# Altium schematic sheet [1]_STLU01.SchDoc
size B
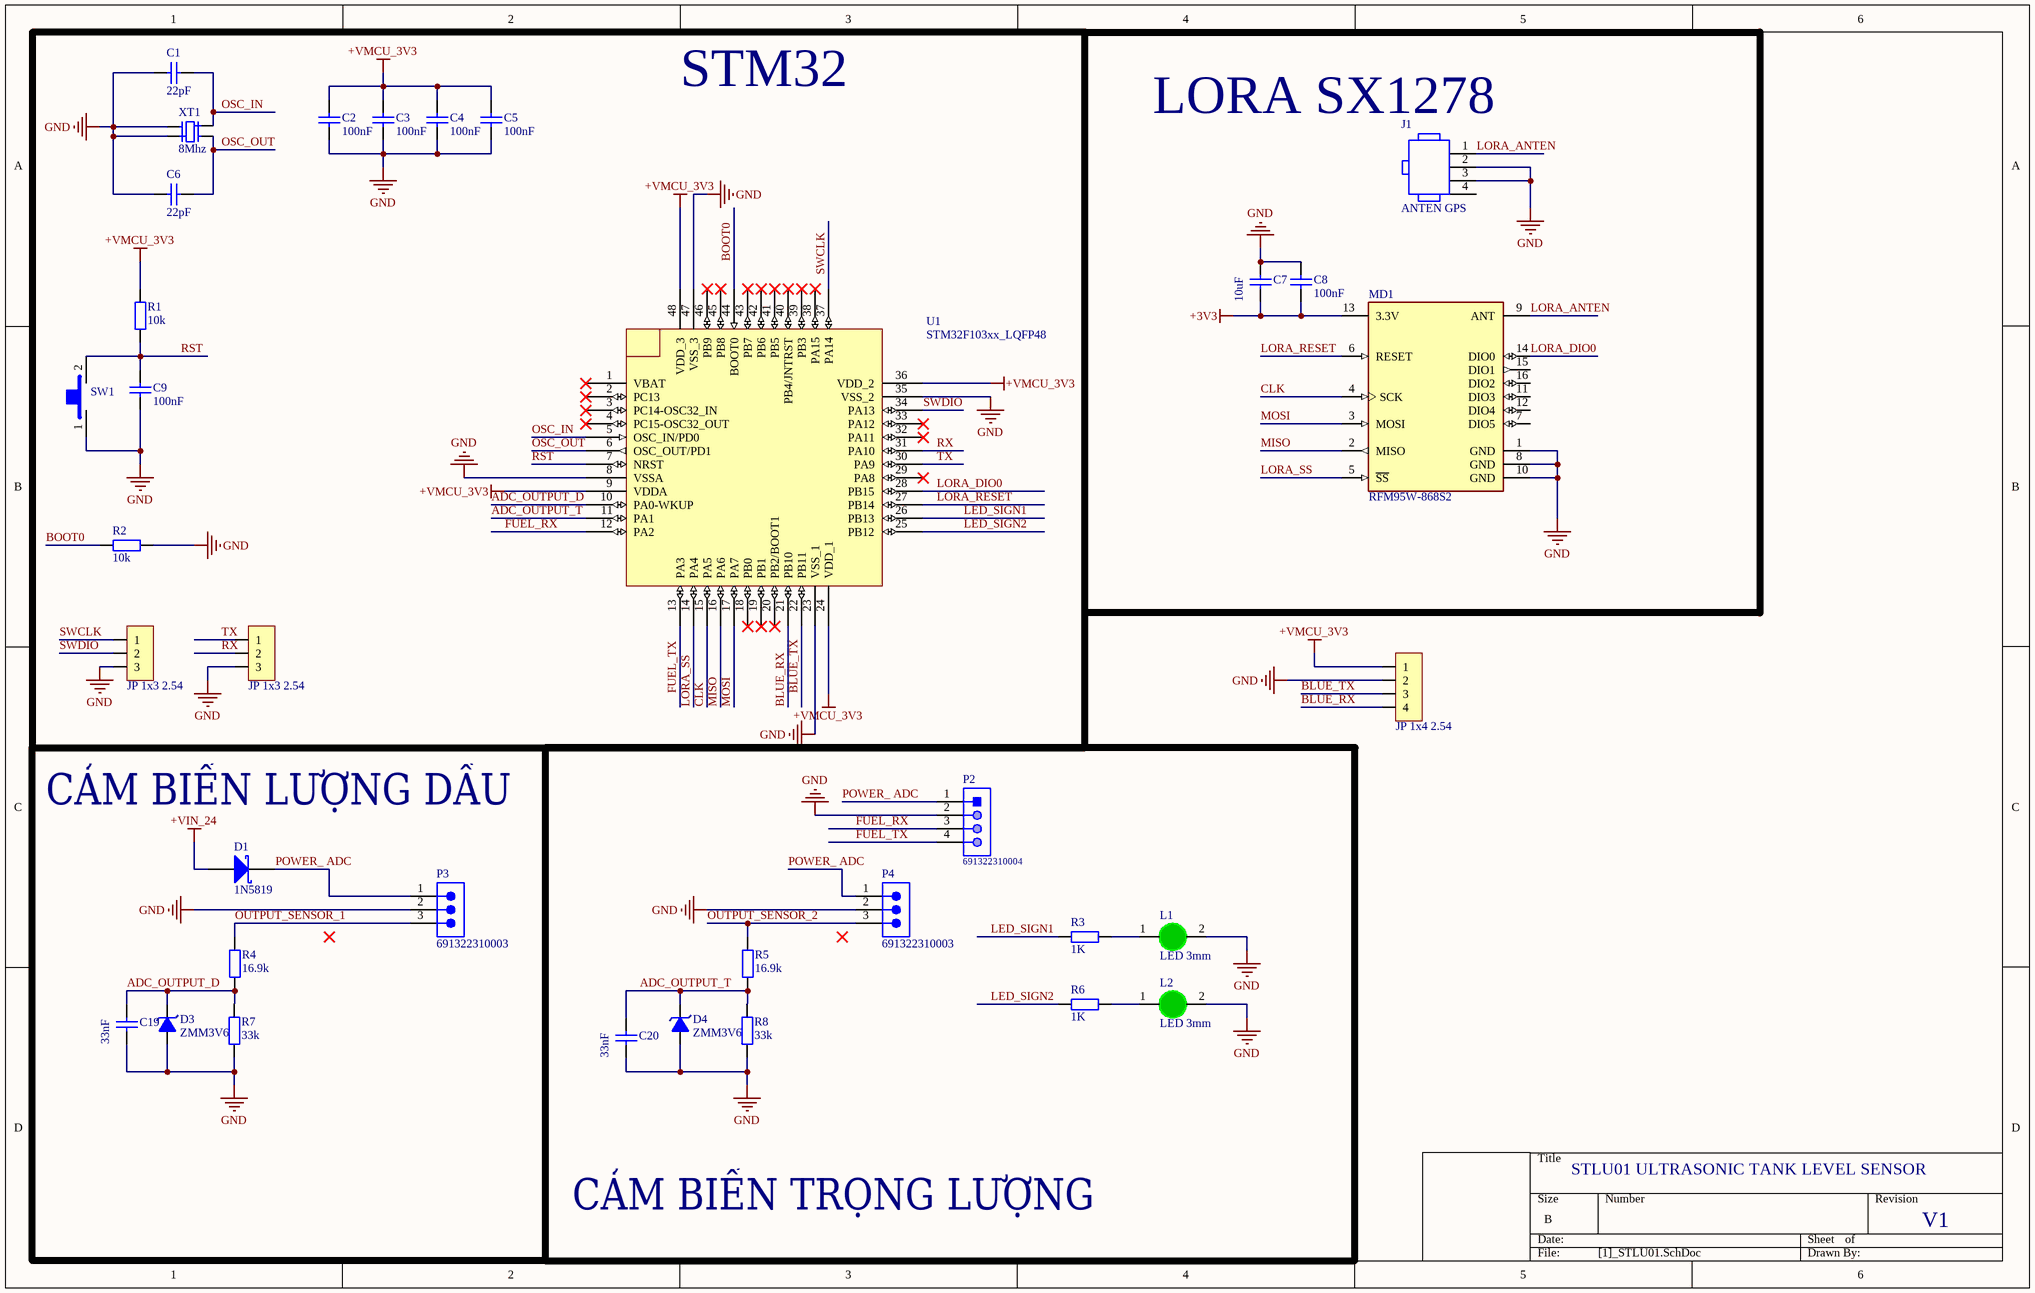
[diagram p0: [1]_STLU01.SchDoc]

## Parts
C1  22pF  [tu 0603]
C2  100nF  [tu 0603]
C3  100nF  [tu 0603]
C4  100nF  [tu 0603]
C5  100nF  [tu 0603]
C6  22pF  [tu 0603]
C7  10uF  [tu 0603]
C8  100nF  [tu 0603]
C9  100nF  [tu 0603]
C19  33nF  [tu 0603]
C20  33nF  [tu 0603]
D1  1N5819  [DO-214AA]
D3  ZMM3V6  [SOD_80]
D4  ZMM3V6  [SOD_80]
J1  ANTEN GPS  [TG-RECE-20369-001E-4_V]
JP1  JP 1x3 2.54  [JP 1x3 DT]
JP2  JP 1x3 2.54  [JP 1x3 DT]
JP3  JP 1x4 2.54  [JP 1x4 DT]
L1  LED 3mm  [LED-3MM-GREEN]
L2  LED 3mm  [LED-3MM-GREEN]
MD1  RFM95W-868S2  [FP-RFM95W-868S2-MFG]
P2  691322310004  [691322310004]
P3  691322310003  [691322310003]
P4  691322310003  [691322310003]
R1  10k  [tro smd 0603]
R2  10k  [tro smd 0603]
R3  1K  [tro smd 0805]
R4  16.9k  [tro smd 0805]
R5  16.9k  [tro smd 0805]
R6  1K  [tro smd 0805]
R7  33k  [tro smd 0805]
R8  33k  [tro smd 0805]
SW1  Tactile  [SW 2P SMD]  (value not drawn)
U1  STM32F103xx_LQFP48  [STM32_LQPF48]
XT1  8Mhz  [Thach Anh 4 chan 1]

## Blocks framed on the sheet
STM32: C1-C6 C9 JP1 JP2 R1 R2 SW1 U1 XT1
CẢM BIẾN LƯỢNG DẦU: C19 D1 D3 P3 R4 R7
CẢM BIẾN TRỌNG LƯỢNG: C20 D4 L1 L2 P2 P4 R3 R5 R6 R8

## Nets
+3V3: C7.2 C8.2 MD1.13(3.3V)
+VIN_24: D1.1(A)
+VMCU_3V3: C2.1 C3.1 C4.1 C5.1 JP3.1 R1.2 U1.9(VDDA) U1.24(VDD_1) U1.36(VDD_2) U1.48(VDD_3)
GND: C1.2 C2.2 C3.2 C4.2 C5.2 C6.2 C7.1 C8.1 C9.2 C19.2 C20.2 D3.1(A) D4.1(A) J1.2 J1.3 JP1.3 JP2.3 JP3.2 L1.2(K) L2.2(K) MD1.1(GND) MD1.8(GND) MD1.10(GND) P2.2 P3.2 P4.2 R2.1 R7.1 R8.1 SW1.1 U1.8(VSSA) U1.23(VSS_1) U1.35(VSS_2) U1.47(VSS_3) XT1.2 XT1.4
ADC_OUTPUT_D: C19.1 D3.2(K) R4.1 R7.2 U1.10(PA0-WKUP)
ADC_OUTPUT_T: C20.1 D4.2(K) R5.1 R8.2 U1.11(PA1)
BLUE_RX: JP3.4 U1.21(PB10)
BLUE_TX: JP3.3 U1.22(PB11)
BOOT0: R2.2 U1.44(BOOT0)
CLK: MD1.4(SCK) U1.15(PA5)
FUEL_RX: P2.3 U1.12(PA2)
FUEL_TX: P2.4 U1.13(PA3)
LED_SIGN1: R3.2 U1.26(PB13)
LED_SIGN2: R6.2 U1.25(PB12)
LORA_ANTEN: J1.1 MD1.9(ANT)
LORA_DIO0: MD1.14(DIO0) U1.28(PB15)
LORA_RESET: MD1.6(RESET) U1.27(PB14)
LORA_SS: MD1.5(~{SS}) U1.14(PA4)
MISO: MD1.2(MISO) U1.16(PA6)
MOSI: MD1.3(MOSI) U1.17(PA7)
OSC_IN: C1.1 U1.5(OSC_IN/PD0) XT1.3
OSC_OUT: C6.1 U1.6(OSC_OUT/PD1) XT1.1
OUTPUT_SENSOR_1: P3.3 R4.2
OUTPUT_SENSOR_2: P4.3 R5.2
POWER_ ADC: D1.2(K) P2.1 P3.1 P4.1
RST: C9.1 R1.1 SW1.2 U1.7(NRST)
RX: JP2.2 U1.31(PA10)
SWCLK: JP1.1 U1.37(PA14)
SWDIO: JP1.2 U1.34(PA13)
TX: JP2.1 U1.30(PA9)
NetL1_1: L1.1(A) R3.1
NetL2_1: L2.1(A) R6.1

Not connected (* = marked no-connect by the designer): J1 4; MD1 7(DIO5) 11(DIO3) 12(DIO4) 15(DIO1) 16(DIO2); U1 1(VBAT)* 2(PC13)* 3(PC14-OSC32_IN)* 4(PC15-OSC32_OUT)* 18(PB0)* 19(PB1)* 20(PB2/BOOT1)* 29(PA8)* 32(PA11)* 33(PA12)* 38(PA15)* 39(PB3)* 40(PB4/JNTRST)* 41(PB5)* 42(PB6)* 43(PB7)* 45(PB8)* 46(PB9)*

## Notes on the sheet
- (near J1) LORA SX1278
- STLU01 ULTRASONIC TANK LEVEL SENSOR
- V1

## Library data of the parts
C1 C6 = Tu 0603 101 50V 10%: Dán; Don_Vi: Con; So_Chan: 2; Ten_Linh_Kien: Tụ 0603 101-0.1nF 10% 50V; Ma_Hang: MH004565; Chung_Loai: Dán; Kieu_Chan: *
C2-C5 C8 = Tu 0603 104 50V 10%: Dán; Don_Vi: Con; So_Chan: 2; Ten_Linh_Kien: Tụ 0603 104-100nF 10% 50V; Ma_Hang: MH004568; Chung_Loai: Dán; Kieu_Chan: *
C7 C19 C20 = Tu 0603 105 16V 20%: Dán; Don_Vi: Con; So_Chan: 2; Ten_Linh_Kien: Tụ 0603 105-1uF 20% 16V; Ma_Hang: MH004574; Chung_Loai: Dán; Kieu_Chan: *
C9 = Tu 0603 105 50V 10%: Dán; Don_Vi: Con; So_Chan: 2; Ten_Linh_Kien: Tụ 0603 105-1uF 50V 10%; Ma_Hang: MH004569; Chung_Loai: Dán; Kieu_Chan: *
D1 = DIO_SS14: DIODE SCHOTTKY 1A 40V SMA DO-214AA; Manufacturer: Fairchild; Part number: SS14; Cost: 600; Package: DO-214AA; ComponentLink1Description: Link product; ComponentLink1URL: https://www.thegioiic.com/ss14-sma-diode-schottky-1a-1n5819
D3 D4 = DIO_ZMM3V6: ZMM3V6 3.6V 500mW SMD SOD-80; Manufacturer: On Semiconductor; Cost: 250; Part number: ZMM3V6; Package: SOD-80; ComponentLink1Description: Link product; ComponentLink1URL: https://www.thegioiic.com/zmm3v6-diode-zener-3-6v-500mw-smd
J1 = CMP-0275-00001-2: RF Connector, Onboard Receptacle, IPEX MHFIII; Manufacturer: Taoglas; PartNumber: RECE-20369-001E-01; Packing: Tape and Reel; Mounting Technology: Surface Mount; PackageReference: RECE-20369-001E-01-4; ComponentLink1URL: http://www.taoglas.com/; Housing Color: Gold; DatasheetVersion: Rev. C; ComponentLink2URL: http://www.taoglas.com/images/product_images/original_images/RECE.20369.001E.01.pdf; ComponentLink3Description: Package Specification; PackageVersion: Rev. C; ComponentLink1Description: Manufacturer URL; ComponentLink2Description: Datasheet; PackageDescription: 4-Pin, Hand Drawn, Body 1.7x1.7mm; ComponentLink3URL: http://www.taoglas.com/images/product_images/original_images/RECE.20369.001E.01.pdf
JP1 JP2 = JP 1x3 2.54 Duc Thang: Cắm; Ten_Linh_Kien: Jump Đơn Đực 2.54MM 1x40P Thẳng 11MM; Don_Vi: Con; Ma_Hang: MH000903; Ghi_Chu: *; Kieu_Chan: *; Chung_Loai: Cắm
JP3 = JP 1x4 2.54 Duc Thang: Cắm; Ten_Linh_Kien: Jump Đơn Đực 2.54MM 1x40P Thẳng 11MM; Don_Vi: Con; Ma_Hang: MH000903; Ghi_Chu: *; Kieu_Chan: *; Chung_Loai: Cắm
L1 L2 = LED 3mm Xanh La: Cắm; Don_Vi: Con; Ma_Hang: MH001054; Ten_Linh_Kien: Led 3MM Phủ Xanh (10c); Ghi_Chu: *; Kieu_Chan: *; Chung_Loai: Cắm
MD1 = CMP-204316-000001-1: RX TXRX MODULE ISM < 1GHZ SMD; Data Rate: 300Kbps; Frequency: 868MHz; Sensitivity: -123dBm; Interface: SPI; Current - Transmitting: 120mA; Current - Receiving: 12.1mA; Max Operating Temperature: 70°C; Case/Package: SMD/SMT; Packaging: Bulk; Mount: Surface Mount; Min Operating Temperature: -20°C
P2 = CMP-1502-01888-1: Serie 322 - 3.81mm Horizontal PCB Header WR-TBL, 4 pin; Manufacturer: Wurth Elektronik; Gender: Male; Pin Number: 4; Package Reference: 691322310004; Part Number: 691322310004; Publisher: WurthElektronik; Packaging: Box; Mounting Technology: THT; Manufacturer URL: http://www.we-online.de; Operating Temperature: -40to105degC; Pitch: 3.81mm; Datasheet URL: http://katalog.we-online.de/em/datasheet/6913223100xx.pdf
P3 P4 = CMP-1502-01887-2: NexarPartId: 8917778; Pitch: 3.81mm; Number of Positions Per Level: 3; Current: 10A; Voltage: 300V; Number of Levels: 1; Gender: Male; Termination: Solder; Number of Rows: 1; Contact Plating: Tin; Packaging: Box; Height: 9.2mm; Mount: Through Hole; Number of Contacts: 3; Width: 12.82mm; Lead Pitch: 3.81mm; REACH SVHC: Unknown; RoHS: Compliant; Length: 10.5mm; Number of Pins: 3; Color: Green; Contact Material: Brass
R1 R2 = Tro 0603 5% 10k: Dán; Don_Vi: Con; So_Chan: 2; Ten_Linh_Kien: Trở 0603 5% 10k; Ma_Hang: MH006316; Chung_Loai: Dán; Kieu_Chan: *
R3-R8 = Tro 0805 5% 1k: Dán; Don_Vi: Con; So_Chan: 2; Ten_Linh_Kien: Trở 0805 5% 1k; Ma_Hang: MH005234; Chung_Loai: Dán; Kieu_Chan: *
SW1 = SW_SPDT_2PIN: SMD Mini Push Button Switch 2 Pin 3x6x2.7mm; Manufacturer: OEM; Part number: SPST 2 PIN SMD; Cost: 600; ComponentLink1Description: Link product; ComponentLink1URL: https://www.thegioiic.com/nut-nhan-3-5x6mm-cao-2-5mm-2-chan-smd-dau-trang
XT1 = Thach Anh 4 Chan SMD: Crystal For all Crystal 2pin.; Value: 4Mhz
U1 = STM32F103xx_LQFP48: Published: 30-May-2008; DatasheetVersion: rev6, Mar-2008; PackageVersion: Mar-2008; PackageReference: LQFP48; Publisher: Altium Limited; PackageDescription: 48-Pin Low-Profile Quad Flat Pack, 7 x 7 mm Body, 0.5 mm Pitch (LQFP48); ComponentLink1Description: Manufacturer Link; ComponentLink1URL: www.st.com/stm32; ComponentLink2Description: Datasheet; ComponentLink2URL: http://www.st.com/stonline/products/literature/ds/13587.pdf